# EAGLE schematic rotation_sensor (EAGLE 7.1.0)
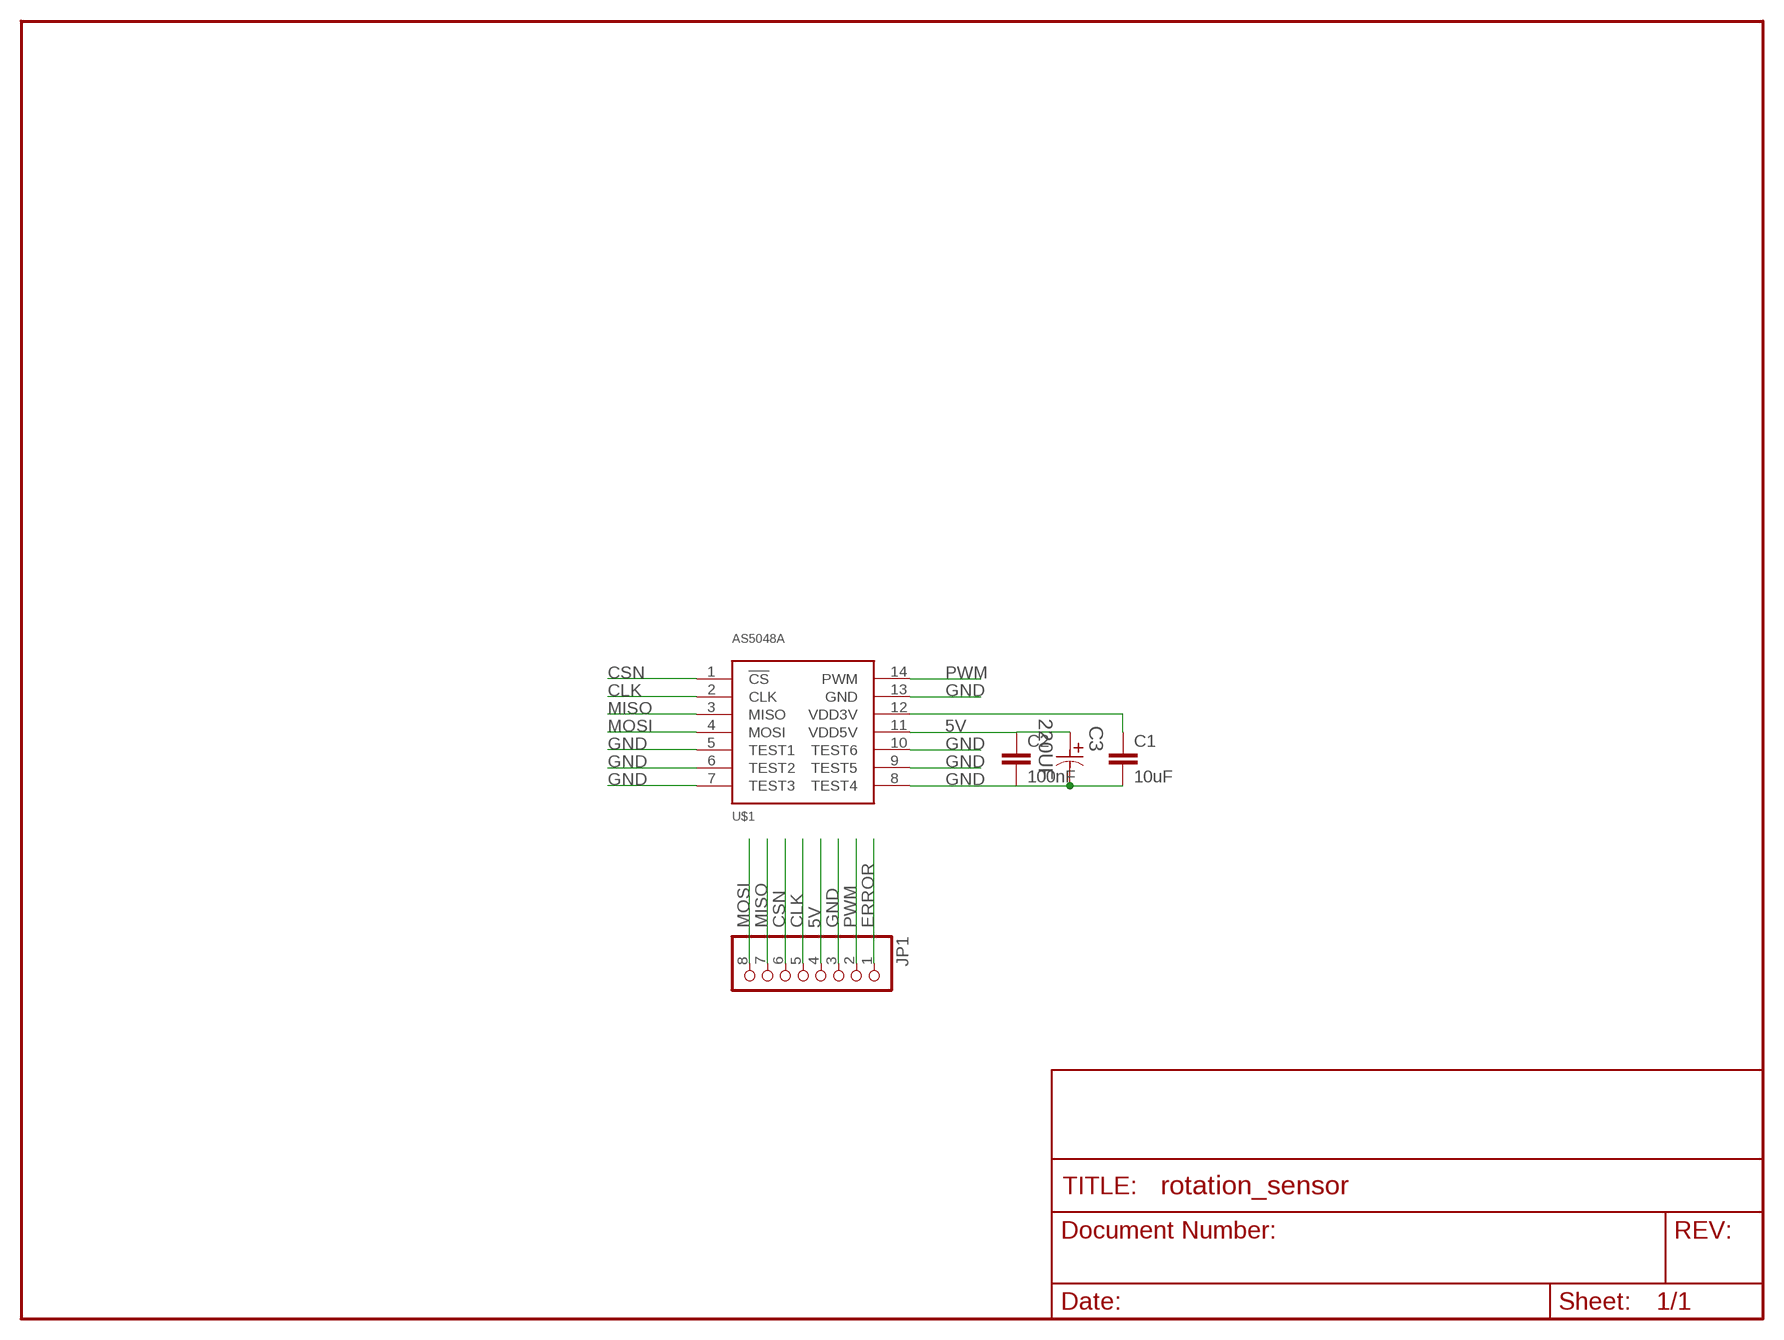
[diagram p0: schematic, sheet 1]

## Parts
C1  10uF  CAP1206  [1206]
C2  100nF  CAP1206  [1206]
C3  220UF  EEE-FK1C221P-CASE-E  [CAPAE830X650N]
JP1  PINHD-1X8M  [1X08M]
U$1  AS5048A  [TSSOP14]

## Nets
5V: C2.1 C3.1 JP1.4 U$1.11(VDD5V)
CLK: JP1.5 U$1.2(CLK)
CSN: JP1.6 U$1.1(!CS)
ERROR: JP1.1
GND: C1.2 C2.2 C3.2 JP1.3 U$1.5(TEST1) U$1.6(TEST2) U$1.7(TEST3) U$1.8(TEST4) U$1.9(TEST5) U$1.10(TEST6) U$1.13(GND)
MISO: JP1.7 U$1.3(MISO)
MOSI: JP1.8 U$1.4(MOSI)
N$1: C1.1 U$1.12(VDD3V)
PWM: JP1.2 U$1.14(PWM)

## Library data of the parts
C1 C2 = SparkFun-Passives:CAP: Capacitor Standard 0603 ceramic capacitor, and 0.1" leaded capacitor.
C3 = Panasonic-EEEFK_EEEFP:EEE-: Aluminum Electrolytic Capacitors,Surface Mount Type; MPN: EEE-FK1C221P; OC_FARNELL: 9695680; OC_NEWARK: 96K9382; PACKAGE: CASE-E; SUPPLIER: PANASONIC; TOLERANCE: ±20 %; VOLTAGERATING: 16V
JP1 = pinhead:PINHD-1X8: PIN HEADER
U$1 = forCNC:AS5048A